# EAGLE design Bertha_v4_4 (EAGLE 6.5.0)
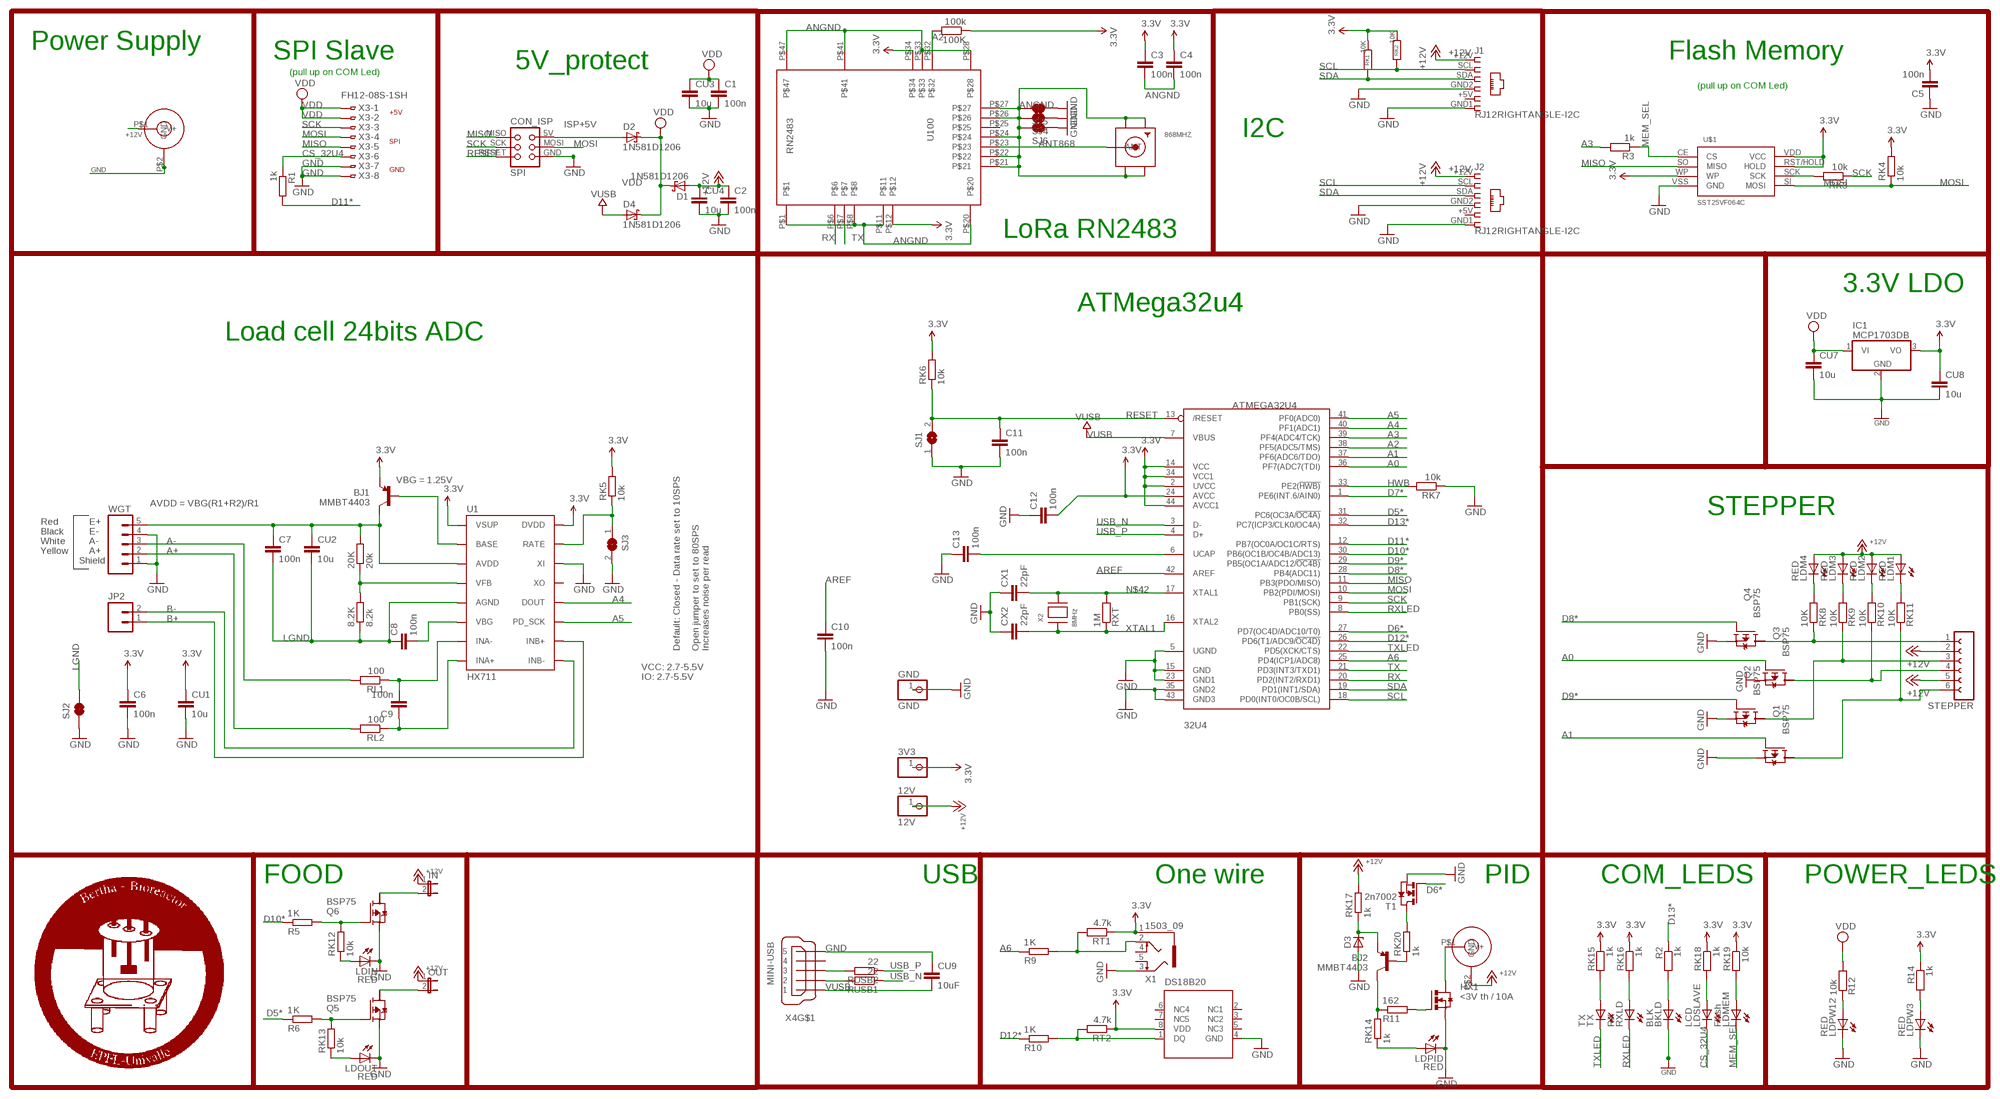
[diagram p0: schematic, sheet 1]

## Parts
3V3  PINHD-1X1  [1X01]
8.2K  8.2k  R-EU_M0805  [M0805]
12V  12V  PINHD-1X1  [1X01]
20K  20k  R-EU_M0805  [M0805]
32U4  ATMEGA32U4  ATMEGA32U4-AU  [TQFP44]
100K  100k  R-EU_R0805  [R0805]
868MHZ  SMACONNECTOR_EDGE  [SMA_EDGELAUNCH]
BJ1  MMBT4403  TRANSISTOR_PNPMMBT4403  [SOT23-3]
BJ2  MMBT4403  TRANSISTOR_PNPMMBT4403  [SOT23-3]
BKLD  BLK  LEDCHIP-LED0805  [CHIP-LED0805]
C1  100n  C-EUC0805  [C0805]
C2  100n  C-EUC0805  [C0805]
C3  100n  C-EUC0805  [C0805]
C4  100n  C-EUC0805  [C0805]
C5  100n  C-EUC0805  [C0805]
C6  100n  C-EUC0805  [C0805]
C7  100n  C-EUC0805  [C0805]
C8  100n  C-EUC0805  [C0805]
C9  100n  C-EUC0805  [C0805]
C10  100n  C-EUC0805  [C0805]
C11  100n  C-EUC0805  [C0805]
C12  100n  C-EUC0805  [C0805]
C13  100n  C-EUC0805  [C0805]
CON1  JACK_DC_BARREL  [DC_BARREL]
CON2  JACK_DC_BARREL  [DC_BARREL]
CON_ISP  SPI  TINYISPT  [TC2030-MCP-NL]
CU1  10u  C-EUC0805  [C0805]
CU2  10u  C-EUC0805  [C0805]
CU3  10u  C-EUC0805  [C0805]
CU4  10u  C-EUC0805  [C0805]
CU7  10u  C-EUC0805  [C0805]
CU8  10u  C-EUC0805  [C0805]
CU9  10uF  C-EUC0805  [C0805]
CX1  22pF  C-EUC0805  [C0805]
CX2  22pF  C-EUC0805  [C0805]
D1  1N581D1206  [LED-1206]
D2  1N581D1206  [LED-1206]
D3  ZENER-DIODEF126-10  [F126Z10]
D4  1N581D1206  [LED-1206]
GND  GND  PINHD-1X1  [1X01]
HX1  <3V th / 10A  IRF3704S  [D2PACK]
IC1  MCP1703DB  [SOT223]
IN  JP1E  [JP1]
J1  RJ12RIGHTANGLE-I2C  [RJ12-RIGHTANGLE-I2C]
J2  RJ12RIGHTANGLE-I2C  [RJ12-RIGHTANGLE-I2C]
JP2  M02PTH  [1X02]
LDIN  RED  LEDCHIP-LED0805  [CHIP-LED0805]
LDM1  RED  LEDCHIP-LED0805  [CHIP-LED0805]
LDM2  RED  LEDCHIP-LED0805  [CHIP-LED0805]
LDM3  RED  LEDCHIP-LED0805  [CHIP-LED0805]
LDM4  RED  LEDCHIP-LED0805  [CHIP-LED0805]
LDMEM  Flash  LEDCHIP-LED0805  [CHIP-LED0805]
LDOUT  RED  LEDCHIP-LED0805  [CHIP-LED0805]
LDPID  RED  LEDCHIP-LED0805  [CHIP-LED0805]
LDPW3  RED  LEDCHIP-LED0805  [CHIP-LED0805]
LDPW12  RED  LEDCHIP-LED0805  [CHIP-LED0805]
LDSLAVE  LCD  LEDCHIP-LED0805  [CHIP-LED0805]
OUT  JP1E  [JP1]
Q1  BSP75  BSP613P  [PG-SOT-223]
Q2  BSP75  BSP613P  [PG-SOT-223]
Q3  BSP75  BSP613P  [PG-SOT-223]
Q4  BSP75  BSP613P  [PG-SOT-223]
Q5  BSP75  BSP613P  [PG-SOT-223]
Q6  BSP75  BSP613P  [PG-SOT-223]
R1  1k  R-EU_R0805  [R0805]
R2  1k  R-EU_R0805  [R0805]
R3  1k  R-EU_R0805  [R0805]
R5  1K  R-EU_R0805  [R0805]
R6  1K  R-EU_R0805  [R0805]
R9  1K  R-EU_R0805  [R0805]
R10  1K  R-EU_R0805  [R0805]
R11  162  R-EU_R0805  [R0805]
R12  10k  R-EU_R0805  [R0805]
R14  1k  R-EU_R0805  [R0805]
RK1  10K  R-EU_M0805  [M0805]
RK2  10K  R-EU_M0805  [M0805]
RK3  10k  R-EU_R0805  [R0805]
RK4  10k  R-EU_R0805  [R0805]
RK5  10k  R-EU_M0805  [M0805]
RK6  10k  R-EU_M0805  [M0805]
RK7  10k  R-EU_M0805  [M0805]
RK8  10K  R-EU_R0805  [R0805]
RK9  10K  R-EU_R0805  [R0805]
RK10  10K  R-EU_R0805  [R0805]
RK11  10K  R-EU_R0805  [R0805]
RK12  10k  R-EU_R0805  [R0805]
RK13  10k  R-EU_R0805  [R0805]
RK14  1k  R-EU_R0805  [R0805]
RK15  1k  R-EU_R0805  [R0805]
RK16  1k  R-EU_R0805  [R0805]
RK17  1k  R-EU_R0805  [R0805]
RK18  1k  R-EU_R0805  [R0805]
RK19  10k  R-EU_R0805  [R0805]
RK20  1k  R-EU_R0805  [R0805]
RL1  100  R-EU_M0805  [M0805]
RL2  100  R-EU_M0805  [M0805]
RT1  4.7k  R-EU_R0805  [R0805]
RT2  4.7k  R-EU_R0805  [R0805]
RUSB1  22  R-EU_M0805  [M0805]
RUSB2  22  R-EU_M0805  [M0805]
RXLD  RX  LEDCHIP-LED0805  [CHIP-LED0805]
RXT  1M  R-EU_R0805  [R0805]
SJ1  SJ  [SJ]
SJ2  JUMPER-PAD-2-NC_BY_TRACE  [PAD-JUMPER-2-NC_BY_TRACE_YES_SILK]
SJ3  SJ  [SJ]
SJ4  JUMPER-PAD-2-NC_BY_TRACE  [PAD-JUMPER-2-NC_BY_TRACE_YES_SILK]
SJ5  JUMPER-PAD-2-NC_BY_TRACE  [PAD-JUMPER-2-NC_BY_TRACE_YES_SILK]
SJ6  JUMPER-PAD-2-NC_BY_TRACE  [PAD-JUMPER-2-NC_BY_TRACE_YES_SILK]
STEPPER  FE06-1  [FE06]
T1  2n7002  NMOSSOT23  [SOT-23]
TX  TX  LEDCHIP-LED0805  [CHIP-LED0805]
U1  HX711  HX711HX711  [SO16]
U100  RN2483  [RN2483]
U$1  SST25VF064C  [SOIC_8-LEAD]
U$2  DS18B20  DS18B20SMALL  [MSOP8]
WGT  M05PTH  [1X05]
X1  1503_09  [1503_09]
X2  8MHz  XTALNX6035  [NX6035]
X3  FH12-08S-1SH  [FH12-08S-1SH]
X4  MINI-USB  MINI-USB-SCHIELD-32005-201  [32005-201]

## Nets
3.3V [power]: 3V3.1 32U4.2(UVCC) 32U4.14(VCC) 32U4.24(AVCC) 32U4.34(VCC1) 32U4.44(AVCC1) 100K.1 BJ1.2(E) C3.1 C4.1 C5.2 C6.1 C12.2 CU1.1 CU8.1 IC1.3(VO) R14.1 RK1.1 RK2.1 RK4.2 RK5.2 RK6.2 RK15.1 RK16.1 RK18.1 RK19.1 RT1.1 RT2.1 U1.1(VSUP) U1.16(DVDD) U100.P$12 U100.P$34 U$1.RST/HOLD(HOLD) U$1.VDD(VCC) U$1.WP U$2.8(VDD) X1.1
+12V [power]: 12V.1 C2.1 CON1.P$1(V+) CON2.P$2(GND) CU4.1 D1.A IN.1 J1.+12V J2.+12V LDM1.A LDM2.A LDM3.A LDM4.A OUT.1 RK17.2 STEPPER.2 STEPPER.5
A0: 32U4.36(PF7(ADC7(TDI)) Q3.1(G)
A1: 32U4.37(PF6(ADC6/TDO)) Q1.1(G)
A2: 32U4.38(PF5(ADC5/TMS)) 100K.2 U100.P$32
A3: 32U4.39(PF4(ADC4/TCK)) R3.2
A4: 32U4.40(PF1(ADC1)) U1.12(DOUT)
A5: 32U4.41(PF0(ADC0)) U1.11(PD_SCK)
A6: 32U4.25(PD4(ICP1/ADC8)) R9.1
A+: RL2.2 WGT.2
A-: RL1.2 WGT.3
ANGND: 868MHZ.GND@1(GND4) 868MHZ.GND@2(GND3) 868MHZ.GND@3(GND2) 868MHZ.GND@4(GND1) C3.2 C4.2 SJ4.2 SJ5.2 SJ6.2 U100.P$1 U100.P$8 U100.P$11 U100.P$20 U100.P$21 U100.P$22 U100.P$24 U100.P$26 U100.P$27 U100.P$28 U100.P$33 U100.P$41 U100.P$47
ANT868: 868MHZ.P(ANT) U100.P$23
AREF: 32U4.42(AREF) C10.1
B+: JP2.1 U1.10(INB+)
B-: JP2.2 U1.9(INB-)
CN3: C8.2 U1.6(VBG)
CS_32U4: LDSLAVE.C R1.1 X3.6
D5*: 32U4.31(PC6(OC3A/!OC4A)) R6.1
D6*: 32U4.27(PD7(OC4D/ADC10/T0)) T1.3(G)
D7*: 32U4.1(PE6(INT.6/AIN0))
D8*: 32U4.28(PB4(ADC11)) Q4.1(G)
D9*: 32U4.29(PB5(OC1A/ADC12/!OC4B)) Q2.1(G)
D10*: 32U4.30(PB6(OC1B/OC4B/ADC13)) R5.1
D11*: 32U4.12(PB7(OC0A/OC1C/RTS)) R1.2
D12*: 32U4.26(PD6(T1/ADC9/!OC4D)) R10.1
D13*: 32U4.32(PC7(ICP3/CLK0/OC4A)) R2.1
GND [power]: 32U4.5(UGND) 32U4.15(GND) 32U4.23(GND1) 32U4.35(GND2) 32U4.43(GND3) BKLD.C C1.2 C2.2 C5.1 C6.2 C10.2 C11.2 C12.1 C13.1 CON1.P$2(GND) CON_ISP.GND CU1.2 CU3.2 CU4.2 CU7.2 CU8.2 CU9.1 CX1.1 CX2.1 D3.A GND.1 HX1.3(S) IC1.2(GND) J1.GND1 J1.GND2 J2.GND1 J2.GND2 LDIN.C LDOUT.C LDPID.C LDPW3.C LDPW12.C Q1.3(S) Q2.3(S) Q3.3(S) Q4.3(S) Q5.3(S) Q6.3(S) RK7.1 SJ1.1 SJ2.1 SJ3.2 SJ4.1 SJ5.1 SJ6.1 T1.2(S) U1.14(XI) U$1.VSS(GND) U$2.4(GND) WGT.1 WGT.4 X1.3 X3.7 X3.8 X4.5
HWB: 32U4.33(PE2(!HWB)) RK7.2
ISP+5V: CON_ISP.5V(VCC) D2.A
LGND: 8.2K.1 C7.2 C8.1 CU2.2 SJ2.2 U1.5(AGND)
MEM_SEL: LDMEM.C R3.1 U$1.CE(CS)
MISO: 32U4.11(PB3(PDO/MISO)) CON_ISP.MISO U$1.SO(MISO) X3.5
MOSI: 32U4.10(PB2(PDI/MOSI)) CON_ISP.MOSI RK4.1 U$1.SI(MOSI) X3.4
N$1: 32U4.6(UCAP) C13.2
N$2: CON2.P$1(V+) HX1.2(D)
N$3: BKLD.A R2.2
N$4: HX1.1(G) R11.2
N$5: 20K.2 BJ1.3(C) C7.1 CU2.1 U1.3(AVDD) WGT.5
N$6: BJ2.3(C) R11.1 RK14.2
N$7: LDPW12.A R12.1
N$8: Q6.1(G) R5.2 RK12.2
N$9 [power]: R10.2 RT2.2 U$2.1(DQ)
N$10: BJ2.2(E) D3.C RK17.1
N$11: Q5.1(G) R6.2 RK13.2
N$12: BJ2.1(B) RK20.1
N$13: OUT.2 Q5.2(D)
N$14 [power]: Q4.2(D) RK8.1 STEPPER.1
N$15 [power]: Q2.2(D) RK9.1 STEPPER.3
N$16 [power]: Q3.2(D) RK10.1 STEPPER.4
N$17: IN.2 Q6.2(D)
N$18: RK15.2 TX.A
N$19 [power]: Q1.2(D) RK11.1 STEPPER.6
N$20: C9.2 RL1.1 U1.7(INA-)
N$21 [power]: R9.2 RT1.2 X1.2
N$22: LDSLAVE.A RK18.2
N$23: RK3.2 U$1.SCK
N$24: RK16.2 RXLD.A
N$25: LDMEM.A RK19.2
N$26 [power]: LDPID.A RK14.1
N$27: LDIN.A RK12.1
N$28: LDOUT.A RK13.1
N$29: RK20.2 T1.1(D)
N$31: LDM4.C RK8.2
N$32: LDM3.C RK9.2
N$33: LDM2.C RK10.2
N$34: LDPW3.A R14.2
N$37: LDM1.C RK11.2
N$38: BJ1.1(B) U1.2(BASE)
N$39: 8.2K.2 20K.1 U1.4(VFB)
N$41: RK5.1 SJ3.1 U1.15(RATE)
N$42: 32U4.17(XTAL1) CX1.2 RXT.2 X2.P$2
N$43: C9.1 RL2.1 U1.8(INA+)
RESET: 32U4.13(/RESET) C11.1 CON_ISP.RESET RK6.1 SJ1.2
RX: 32U4.20(PD2(INT2/RXD1)) U100.P$6
RXLED: 32U4.8(PB0(SS)) RXLD.C
SCK: 32U4.9(PB1(SCK)) CON_ISP.SCK RK3.1 X3.3
SCL: 32U4.18(PD0(INT0/OC0B/SCL)) J1.SCL J2.SCL RK2.2
SDA: 32U4.19(PD1(INT1/SDA)) J1.SDA J2.SDA RK1.2
TX: 32U4.21(PD3(INT3/TXD1)) U100.P$7
TXLED: 32U4.22(PD5(XCK/CTS)) TX.C
USB_N: 32U4.3(D-) RUSB1.1
USB_P: 32U4.4(D+) RUSB2.1
USBC_N: RUSB1.2 X4.2
USBC_P: RUSB2.2 X4.3
VDD [power]: C1.1 CU3.1 CU7.1 D1.C D2.C D4.C IC1.1(VI) R12.2 X3.1 X3.2
VUSB: 32U4.7(VBUS) CU9.2 D4.A X4.1
XTAL1: 32U4.16(XTAL2) CX2.2 RXT.1 X2.P$1
Unconnected: Q1.4(D) Q2.4(D) Q3.4(D) Q4.4(D) Q5.4(D) Q6.4(D) U1.13(XO) U100.P$25 U$2.2(NC1) U$2.3(NC2) U$2.5(NC3) U$2.6(NC4) U$2.7(NC5) X1.4 X1.5 X4.4 X4.M1(S:S1) X4.M2(S:S2) X4.M3(S:S3) X4.M4(S:S4)

## Notes on the sheet
- Power Supply
- SPI Slave | Flash Memory
- 5V_protect
- (pull up on COM Led)
- (pull up on COM Led)
- +5V
- I2C
- SPI
- GND
- LoRa RN2483
- 3.3V LDO
- ATMega32u4
- Load cell 24bits ADC
- VBG = 1.25V
- AVDD = VBG(R1+R2)/R1
- STEPPER
- Red | E+
- Black | E-
- White | A-
- Yellow | A+
- Shield
- Default: Closed - Data rate set to 10SPS
- Open jumper to set to 80SPS
  Increases noise per read
- VCC: 2.7-5.5V
- IO: 2.7-5.5V
- FOOD | USB | One wire | PID | COM_LEDS | POWER_LEDS

## Power pins joined to a net without a drawn wire
5: J1.+5V J2.+5V

## Library data of the parts
3V3 12V GND = Headerlibrary:PINHD-1X1: PIN HEADER
8.2K 20K R14 RK1 RK2 RK5-RK7 RL1 RL2 RT1 RT2 RUSB1 RUSB2 = resistor:R-EU_: RESISTOR, European symbol
32U4 = adafruit:ATMEGA32U4: http://www.ladyada.net/library/eagle
100K R1-R3 R5 R6 R9-R12 RK3 RK4 RK8-RK20 RXT = rcl:R-EU_: RESISTOR, European symbol
868MHZ = sma_end_launch:SMACONNECTOR: SMA Connector 90° DIP SMA Connector, 50 Ohm (4UConnector: 07259)
BJ1 BJ2 = SparkFun-DiscreteSemi:TRANSISTOR_PNP: Generic PNP BJT Double check pinouts against datasheets- not all devices are the same! MMBT3906 - 40V 200mA SOT-23 (TRANS-08052) MMBT4403 - 40V 600mA SOT-23 (TRANS-09245); PROD_ID: TRANS-09245
BKLD LDIN LDM1-LDM4 LDMEM LDOUT LDPID LDPW3 LDPW12 LDSLAVE RXLD TX = adafruit:LED: LED OSRAM: - CHIPLED LG R971, LG N971, LY N971, LG Q971, LY Q971, LO R971, LY R971 LH N974, LH R974 LS Q976, LO Q976, LY Q976 LO Q996 - Hyper CHIPLED LW Q18S LB Q993, LB Q99A, LB R99A - SideLED LS A670, LO A670, LY A670, LG A670, LP A670 LB A673, LV A673, LT A673, LW A673 LH A674 LY A675 LS A676, LA A676, LO A676, LY A676, LW A676 LS A679, LY A679, LG A679 - Hyper Micro SIDELED® LS Y876, LA Y876, LO Y876, LY Y876 LT Y87S - SmartLED LW L88C, LW L88S LB L89C, LB L89S, LG L890 LS L89K, LO L89K, LY L89K LS L896, LA L896, LO L896, LY L896 - TOPLED LS T670, LO T670, LY T670, LG T670, LP T670 LSG T670, LSP T670, LSY T670, LOP T670, LYG T670 LG T671, LOG T671, LSG T671 LB T673, LV T673, LT T673, LW T673 LH T674 LS T676, LA T676, LO T676, LY T676, LB T676, LH T676, LSB T676, LW T676 LB T67C, LV T67C, LT T67C, LS T67K, LO T67K, LY T67K, LW E67C LS E67B, LA E67B, LO E67B, LY E67B, LB E67C, LV E67C, LT E67C LW T67C LS T679, LY T679, LG T679 LS T770, LO T770, LY T770, LG T770, LP T770 LB T773, LV T773, LT T773, LW T773 LH T774 LS E675, LA E675, LY E675, LS T675 LS T776, LA T776, LO T776, LY T776, LB T776 LHGB T686 LT T68C, LB T68C - Hyper Mini TOPLED® LB M676 - Mini TOPLED Santana® LG M470 LS M47K, LO M47K, LY M47K Source: http://www.osram.convergy.de/
C1-C13 CU1-CU4 CU7-CU9 CX1 CX2 = rcl:C-EU: CAPACITOR, European symbol
CON1 CON2 = lpatiny:JACK_DC_BARREL
CON_ISP = lpatiny:TINYISP: CONNECTOR
D1 D2 D4 = lpatiny:1N581*: 1.0A SCHOTTKY BARRIER RECTIFIER Source: http://www.diodes.com/datasheets/ds23001.pdf
D3 = diode:ZENER-DIODE: Z-Diode
HX1 = transistor-power:IRF3704: SMPS MOSFET HEXFET® Power MOSFET Source: http://www.irf.com/product-info/datasheets/data/irf3704.pdf
IC1 = linear:MCP1703: 250 mA, 16V, Low Quiescent Current LDO Regulator Source: http://ww1.microchip.com/downloads/en/DeviceDoc/22049b.pdf
IN OUT = jumper:JP1E: JUMPER
J1 J2 = lpatiny:RJ12: CORCOM Modular RJ Jacks No Shield Source: www.tycoelectronics.com .. ENG_DS_1654001_1099_RJ_L_0507.pdf
JP2 = SparkFun-Connectors:M02: Standard 2-pin 0.1" header. Use with - straight break away headers ( PRT-00116) - right angle break away headers (PRT-00553) - swiss pins (PRT-00743) - machine pins (PRT-00117) - female headers (PRT-00115) Molex polarized connector foot print use with: PRT-08233 with associated crimp pins and housings. 2.54_SCREWTERM for use with PRT-10571. 3.5mm Screw Terminal footprints for PRT-08084 5mm Screw Terminal footprints for use with PRT-08432
Q1-Q6 = infineon:BSP613P: SIPMOS (R) Small-Signal-Transistor P-Channel (2 Drain) Source: http://www.infineon.com/dgdl/BSP613P_Rev2.4.pdf; OC_FARNELL: unknown; OC_NEWARK: unknown
SJ1 SJ3 = jumper:SJ: SMD solder JUMPER
SJ2 SJ4-SJ6 = SparkFun-Passives:JUMPER-PAD-2-NC_BY_TRACE
STEPPER = con-lsta:FE06-1: FEMALE HEADER; OC_FARNELL: unknown; OC_NEWARK: unknown
T1 = zetex:NMOSSOT23: MOS FET; OC_FARNELL: unknown; OC_NEWARK: unknown
U1 = Testing:HX711; PROD_ID: IC-12445
U100 = Octanis1:RN2483: Microchip Low-Power Long Range LoRaTM Technology Transceiver Module
U$1 = BertaLib:SST25VF064C
U$2 = lpatiny:DS18B20
WGT = SparkFun-Connectors:M05: Header 5 Standard 5-pin 0.1" header. Use with straight break away headers (SKU : PRT-00116), right angle break away headers (PRT-00553), swiss pins (PRT-00743), machine pins (PRT-00117), and female headers (PRT-00115). Molex polarized connector foot print use with SKU : PRT-08230 with associated crimp pins and housings.
X1 = con-lumberg:1503_09: Jack connectors according to JISC 6560, 3.5 mm Klinkeneinbaukupplung nach JISC 6560, 3,5 mm, 3-polig/ stereo, abgewinkelte Ausführung, mit 2 Öffnern und Lötaugen, für Leiterplatten Rückseitenmontage Source: http://www.lumberg.com/Produkte/PDFs/1503_09.pdf; OC_FARNELL: 1243244; OC_NEWARK: unknown
X2 = lpatiny:XTAL: Low cost SMT crystals, no capacitors included http://www.ladyada.net/library/eagle
X3 = con-hirose:FH12-08S-1S: 1mm Pitch Connectors For FPC/FFC Source: Data sheet <http://www.hirose.co.jp/cataloge_hp/e58605370.pdf>; OC_FARNELL: unknown; OC_NEWARK: unknown
X4 = con-cypressindustries:MINI-USB-SCHIELD-: MINI USB-B Conector Source: www.cypressindustries.com; OC_FARNELL: unknown; OC_NEWARK: unknown

## Net classes
0 default: width 0.203 mm, clearance 0.25 mm
1 power: width 0.203 mm, drill 0.305 mm, clearance 0.25 mm
2 VIN: width 0.457 mm, clearance 0.25 mm
3 fine: width 0.254 mm, clearance 0.25 mm
4 aref: width 0.356 mm, clearance 0.25 mm

## Board
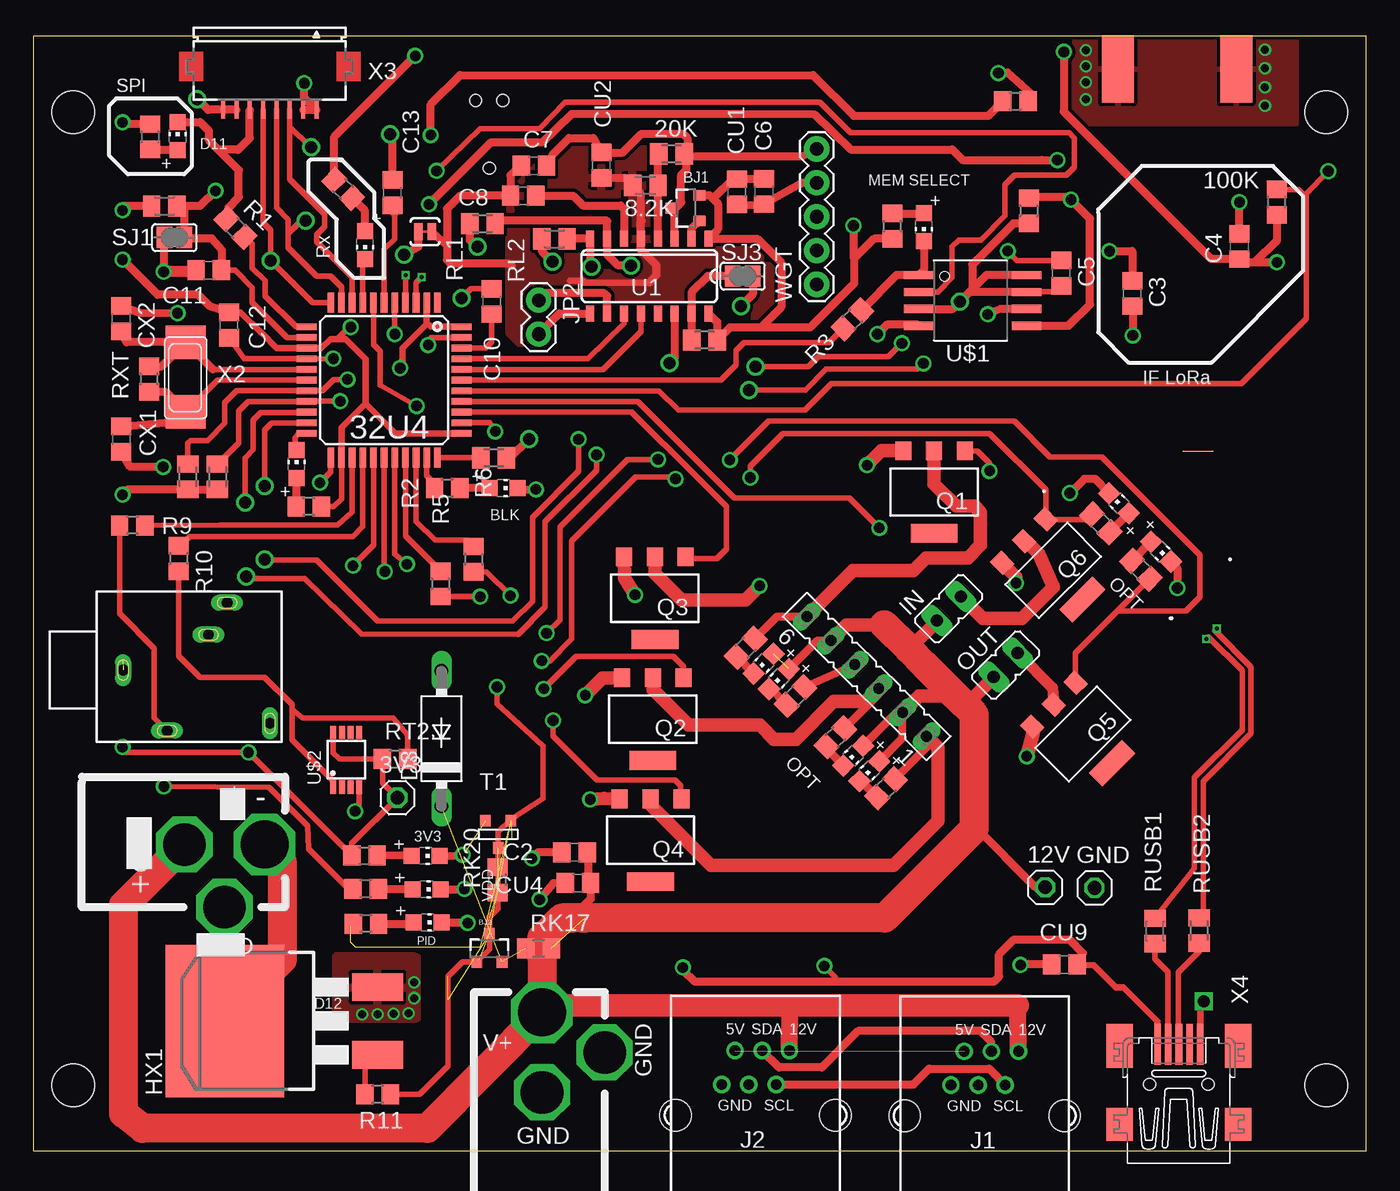
[diagram p1: board, top side]
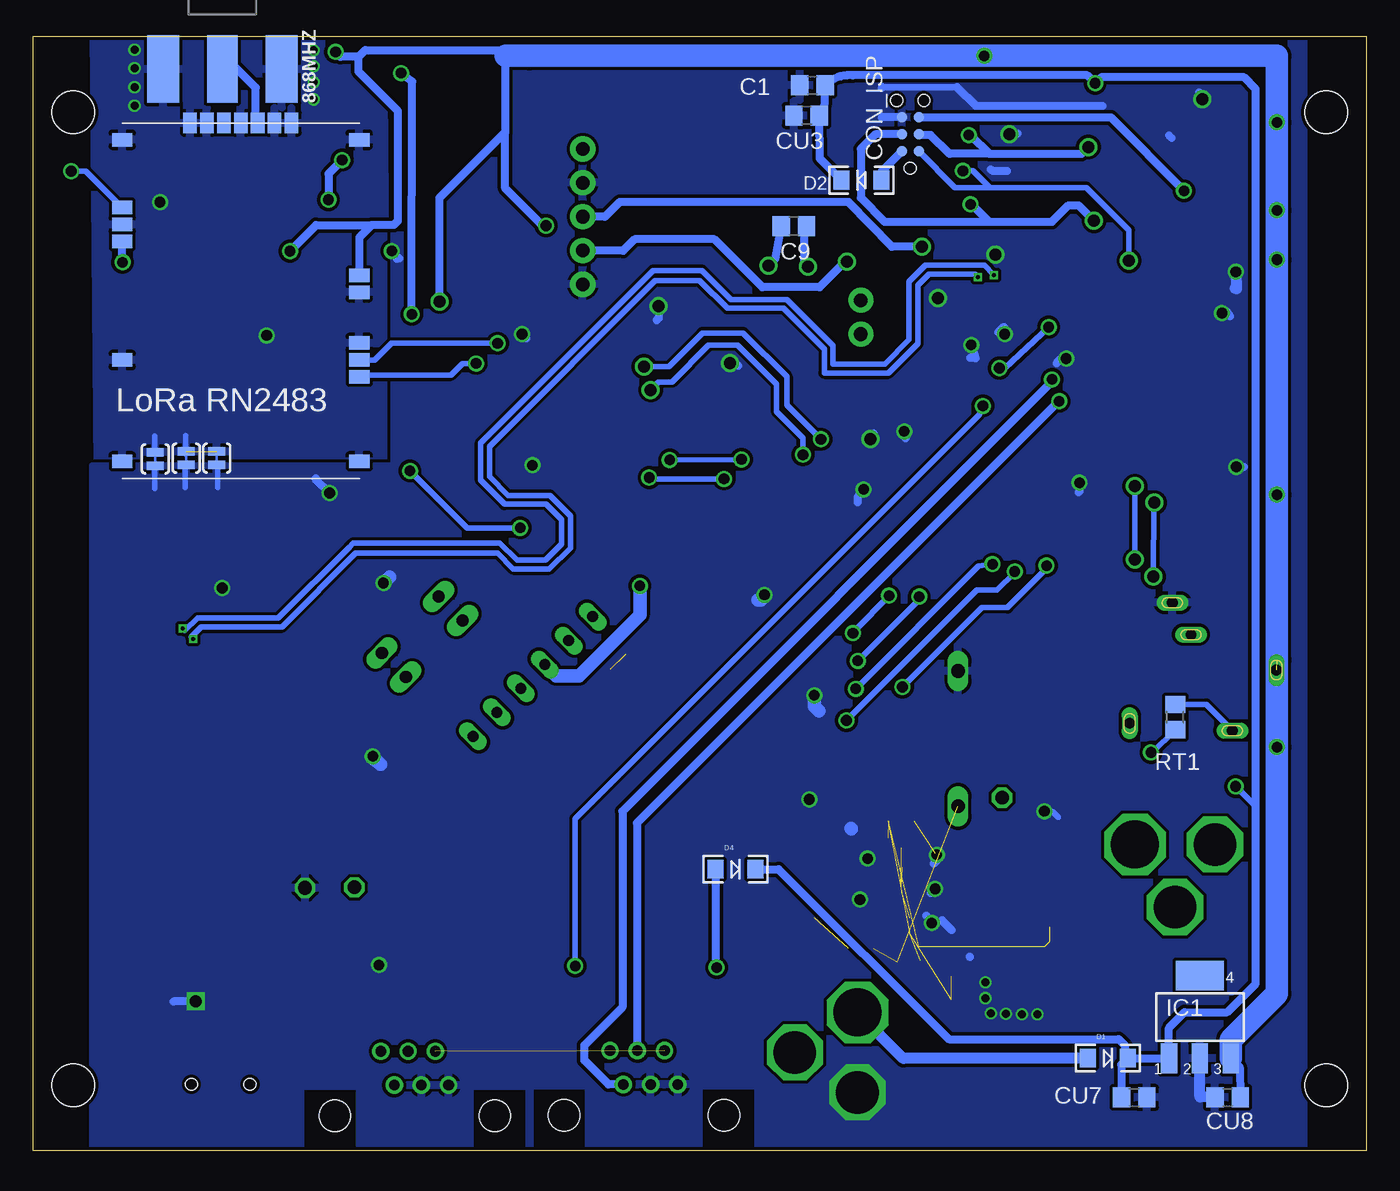
[diagram p2: board, bottom side, seen from below]

Size 100 x 83.6 mm. Coordinates in mm from the lower left corner, seen from the top.
Outline: 0,0 100,0 100,83.6 0,83.6 0,0
Copper layers (1*2*15*16): Top 0.035mm / dielectric 0.2mm / layer 2 0.0175mm / dielectric 1.1mm / layer 15 0.0175mm / dielectric 0.2mm / Bottom 0.035mm
Design rules "SeeedStudio_DRU_no_angle_20130527": minimum track width 6mil, minimum drill 12mil, track to track 6mil, track to pad 6mil, pad to pad 6mil, via to via 6mil, smd to smd 0mil, copper to edge 10mil, drill to drill 10mil, minimum pad ring 6mil, minimum via ring 6mil, stop-mask expansion 2mil, vias tented up to drill 25mil, thermal gap 10mil
Holes 3.2 mm at 3,77.9 97,77.9 3,4.9 97,4.9
vRestrict: area 13.7,77 to 21.9,80.8

### Footprints (pad centres in the part's own frame; a part is rotated, then mirrored left to right if it is on the bottom)
1X01 = drill 1.016 octagon: 1 0,0
M0805 = smd 1.3 x 1.6: 1 -0.95,0; 2 0.95,0
TQFP44 = smd 1.5 x 0.5: 1 -5.8,4; 2 -5.8,3.2; 3 -5.8,2.4; 4 -5.8,1.6; 5 -5.8,0.8; 6 -5.8,0; 7 -5.8,-0.8; 8 -5.8,-1.6; 9 -5.8,-2.4; 10 -5.8,-3.2; 11 -5.8,-4; 23 5.8,-4; 24 5.8,-3.2; 25 5.8,-2.4; 26 5.8,-1.6; 27 5.8,-0.8; 28 5.8,0; 29 5.8,0.8; 30 5.8,1.6; 31 5.8,2.4; 32 5.8,3.2; 33 5.8,4 | smd 0.5 x 1.5: 12 -4,-5.8; 13 -3.2,-5.8; 14 -2.4,-5.8; 15 -1.6,-5.8; 16 -0.8,-5.8; 17 0,-5.8; 18 0.8,-5.8; 19 1.6,-5.8; 20 2.4,-5.8; 21 3.2,-5.8; 22 4,-5.8; 34 4,5.8; 35 3.2,5.8; 36 2.4,5.8; 37 1.6,5.8; 38 0.8,5.8; 39 0,5.8; 40 -0.8,5.8; 41 -1.6,5.8; 42 -2.4,5.8; 43 -3.2,5.8; 44 -4,5.8
R0805 = smd 1.3 x 1.5: 1 -0.95,0; 2 0.95,0
SMA_EDGELAUNCH = smd 5.08 x 2.413: GND@1 2.54,-4.445; GND@2 2.54,4.445 | smd 5.08 x 2.413 bottom: GND@3 2.54,4.445; GND@4 2.54,-4.445 | smd 5.08 x 2.286: P 2.54,0
SOT23-3 = smd 0.8 x 0.9: 1 -0.95,-1; 2 0.95,-1; 3 0,1.1
CHIP-LED0805 = smd 1.2 x 1.2: A 0,-1.05; C 0,1.05
C0805 = smd 1.3 x 1.5: 1 -0.95,0; 2 0.95,0
DC_BARREL = drill 3.6 pad 4.5 octagon: P$1 0,13.7 | drill 3.2 pad 4.064 octagon: P$2 0,7.7; P$3 4.7,10.7
TC2030-MCP-NL = smd 0.787 x 0.787: 5V 1.27,0.635; GND 3.81,0.635; MISO 1.27,-0.635; MOSI 2.54,0.635; RESET 3.81,-0.635; SCK 2.54,-0.635 | hole 0.889: 0,0; 5.08,-1.016; 5.08,1.016
LED-1206 = smd 1.2 x 1.4: A -1.5,0; C 1.5,0
F126Z10 = drill 1.016 long: A 5.08,0; C -5.08,0
D2PACK = smd 2.083 x 3.81: 1 -2.54,-8.89; 3 2.54,-8.89 | smd 11.43 x 8.89: 2 0,2.54
SOT223 = smd 1.219 x 2.235: 1 -2.311,-3.099; 2 0,-3.099; 3 2.311,-3.099 | smd 3.6 x 2.2: 4 0,3.099
JP1 = drill 0.914 long: 1 0,-1.27; 2 0,1.27
RJ12-RIGHTANGLE-I2C = drill 0.8 pad 1.3: +5V -1.54,4.84; +12V 2.54,4.84; GND1 -2.54,2.3; GND2 -0.5,2.3; SCL 1.54,2.3; SDA 0.5,4.84 | hole 2.36: -6,0; 6,0
1X02 = drill 1.016 pad 1.88: 1 0,0; 2 2.54,0
PG-SOT-223 = smd 1.2 x 1.4: 1 -2.311,-3.099; 2 0,-3.099; 3 2.311,-3.099 | smd 3.5 x 1.4: 4 0,3.099
SJ = smd 1.168 x 1.6: 1 -0.762,0; 2 0.762,0
PAD-JUMPER-2-NC_BY_TRACE_YES_SILK = smd 0.635 x 1.27: 1 -0.508,0; 2 0.508,0
FE06 = drill 0.813 long: 1 -6.35,0; 2 -3.81,0; 3 -1.27,0; 4 1.27,0; 5 3.81,0; 6 6.35,0
SOT-23 = smd 0.787 x 0.889: 1 0.025,-1.016; 2 -0.94,1.016; 3 0.991,1.016
SO16 = smd 0.6 x 1.2: 1 -4.445,-2.8; 2 -3.175,-2.8; 3 -1.905,-2.8; 4 -0.635,-2.8; 5 0.635,-2.8; 6 1.905,-2.8; 7 3.175,-2.8; 8 4.445,-2.8; 9 4.445,2.8; 10 3.175,2.8; 11 1.905,2.8; 12 0.635,2.8; 13 -0.635,2.8; 14 -1.905,2.8; 15 -3.175,2.8; 16 -4.445,2.8
RN2483 = smd 1.524 x 1.016: P$1 17.78,1.27; P$6 17.78,7.62; P$7 17.78,8.89; P$8 17.78,10.16; P$11 17.78,13.97; P$12 17.78,15.24; P$20 17.78,25.4; P$28 0,25.4; P$32 0,20.32; P$33 0,19.05; P$34 0,17.78; P$41 0,8.89; P$47 0,1.27 | smd 1.016 x 1.524: P$21 12.7,26.67; P$22 11.43,26.67; P$23 10.16,26.67; P$24 8.89,26.67; P$25 7.62,26.67; P$26 6.35,26.67; P$27 5.08,26.67
SOIC_8-LEAD = smd 0.61 x 2.21: CE -1.905,-2.934; RST/HOLD -0.635,5.156; SCK 0.635,5.156; SI 1.905,5.156; SO -0.635,-2.934; VDD -1.905,5.156; VSS 1.905,-2.934; WP 0.635,-2.934
MSOP8 = smd 0.45 x 1: 1 -0.975,-2.05; 2 -0.325,-2.05; 3 0.325,-2.05; 4 0.975,-2.05; 5 0.975,2.05; 6 0.325,2.05; 7 -0.325,2.05; 8 -0.975,2.05
1X05 = drill 1.016 pad 1.88: 1 0,0; 2 2.54,0; 3 5.08,0; 4 7.62,0; 5 10.16,0
1503_09 = drill 0.8 pad 1.2 long: 1 0,-2.1; 2 -4.55,-5.4; 3 5.05,-9.9; 4 -4,-13.1; 5 2.65,-8.5
NX6035 = smd 2.5 x 3: P$1 2.665,0; P$2 -2.565,0
FH12-08S-1SH = smd 0.3 x 1.3: 1 -3.5,3.25; 2 -2.5,3.25; 3 -1.5,3.25; 4 -0.5,3.25; 5 0.5,3.25; 6 1.5,3.25; 7 2.5,3.25; 8 3.5,3.25
32005-201 = smd 3.1 x 0.5: 1 3,1.6; 2 3,0.8; 3 3,0; 4 3,-0.8; 5 3,-1.6 | smd 2.5 x 2: M1 -3,-4.45; M2 -3,4.45 | smd 3.3 x 2: M3 2.9,4.45; M4 2.9,-4.45 | hole 0.9: 0,2.2; 0,-2.2

### Placement (x,y rotation side)
3V3  27.31,26.48 0 top
8.2K  45.92,72.41 0 top
12V  75.9,19.75 0 top
20K  47.88,74.77 0 top
32U4  26.31,57.81 270 top
100K  93.29,71.16 90 top
868MHZ  85.8,83.68 270 bottom
BJ1  48.97,70.71 90 top
BJ2  34.21,15.14 0 top
BKLD  35.29,49.7 270 top
C1  41.55,79.92 180 bottom
C2  40.6,22.38 180 top
C3  82.44,64.31 270 top
C4  90.48,67.84 90 top
C5  77.11,65.84 270 top
C6  54.82,71.96 270 top
C7  37.55,73.88 180 top
C8  36.76,71.63 0 top
C9  42.94,69.36 180 bottom
C10  34.4,63.71 90 top
C11  13.17,66.04 180 top
C12  14.68,61.93 90 top
C13  26.94,71.87 270 top
CON1  38.16,-3.34 0 top
CON2  3.64,22.96 270 top
CON_ISP  34.21,73.71 90 bottom
CU1  52.78,71.94 270 top
CU2  42.62,73.94 270 top
CU3  41.98,77.66 180 bottom
CU4  40.86,20.08 180 top
CU7  17.41,3.98 0 bottom
CU8  10.39,3.99 180 bottom
CU9  77.35,13.95 0 top
CX1  6.6,53.38 90 top
CX2  6.6,62.42 270 top
D1  19.37,6.94 0 bottom
D2  37.87,72.81 180 bottom
D3  30.62,30.9 90 top
D4  47.3,21.11 0 bottom
GND  79.61,19.71 0 top
HX1  16.93,9.72 90 top
IC1  12.47,10.02 0 bottom
IN  68.69,40.67 315 top
J1  71.38,2.61 0 top
J2  54.19,2.66 0 top
JP2  37.91,63.8 270 top
LDIN  81.44,48.57 45 top
LDM1  54.79,36.53 135 top
LDM2  55.93,35.38 135 top
LDM3  61.52,29.63 135 top
LDM4  62.72,28.46 135 top
LDMEM  66.8,69.28 180 top
LDOUT  84.6,44.94 225 top
LDPID  29.57,17.13 270 top
LDPW3  29.44,22.12 270 top
LDPW12  29.49,19.6 270 top
LDSLAVE  10.83,76.12 0 top
OUT  72.95,36.43 315 top
Q1  67.58,49.41 180 top
Q2  46.48,32.37 180 top
Q3  46.64,41.44 180 top
Q4  46.31,23.28 180 top
Q5  78.75,31.26 225 top
Q6  76.51,43.53 225 top
R1  15.17,69.23 315 top
R2  31.05,49.72 0 top
R3  61.45,62.37 225 top
R5  30.55,42.52 270 top
R6  33.05,44.37 270 top
R9  7.43,46.91 180 top
R10  10.92,44.42 270 top
R11  25.83,4.21 180 top
R12  24.93,19.64 180 top
R14  24.84,22.13 0 top
RK1  13.82,50.55 90 top
RK2  11.6,50.56 90 top
RK3  73.68,78.73 0 top
RK4  74.69,70.5 270 top
RK5  50.36,60.81 0 top
RK6  9.84,70.86 180 top
RK7  34.54,51.98 180 top
RK8  63.97,27.19 225 top
RK9  60.18,31.01 225 top
RK10  57.18,34.11 225 top
RK11  53.45,37.73 225 top
RK12  80.09,47.05 135 top
RK13  83.09,43.59 315 top
RK14  24.96,17.03 180 top
RK15  20.67,48.32 180 top
RK16  23.25,72.15 315 top
RK17  37.91,15.17 0 top
RK18  8.76,76.06 270 top
RK19  64.46,69.36 90 top
RK20  34.83,20.31 90 top
RL1  33.7,69.55 180 top
RL2  39.09,68.39 180 top
RT1  14.34,32.52 90 bottom
RT2  27.15,29.38 0 top
RUSB1  84.16,16.47 270 top
RUSB2  87.47,16.5 270 top
RXLD  24.88,67.93 180 top
RXT  8.68,57.89 270 top
SJ1  10.59,68.5 0 top
SJ2  29.39,68.93 0 top
SJ3  53.22,65.61 0 top
SJ4  88.53,51.95 90 bottom
SJ5  86.23,51.95 90 bottom
SJ6  90.85,51.89 90 bottom
STEPPER  62.53,35.57 135 top
T1  34.85,23.73 0 top
TX  19.75,51.51 0 top
U1  46.22,65.61 180 top
U100  93.33,50.43 0 bottom
U$1  69.37,63.79 270 top
U$2  23.48,29.32 0 top
WGT  58.78,64.99 90 top
X1  4.64,36.05 90 top
X2  11.43,57.99 90 top
X3  17.75,81.33 180 top
X4  85.94,4.98 90 top

### Tracks (layer width: path | path; a pad name or v marks a point on that pad's centre or on a via)
3.3V  (via drill 0.8, 0.8 pad 0.81, 0.9 pad 0.61)  (1 unrouted)
  Top 0.406: 20.53,60.21 32U4.14 | RK15.1 22.54,48.32 23.11,48.89 32U4.24 | 74.54,64.44 76.66,64.44 arc90 C5.2 | v6.7,30.27 arc90 7.1,29.87 v16.15,29.87 R14.1 23.89,23.05 3V3.1 26.2,27.59 RT2.1 23,29.38 22.49,29.84 22.49,31.34 U$2.8
  Top 0.5: 24.93,56.06 23.11,54.24 32U4.24 | 24.93,56.06 24.93,59.39 23.44,60.88 22.81,60.88 | 22.81,60.88 22.3,60.88 21.58,60.21 20.53,60.21 | 32U4.34 27.18,53.81 24.93,56.06 | 32U4.44 29.83,61.81 29.52,62.12 | 32U4.2 29.52,62.12 | 29.52,62.12 29.52,62.02 27.7,60.2 27.7,58.89 v27.52,58.71 | 23.81,61.88 22.81,60.88 | 32U4.14 18.27,60.21 17.15,61.33 17.12,61.33 15.57,62.88 C12.2
  Top 0.61: U$1.WP 68.97,63.15 v69.52,63.7 | U$1.VDD 71.51,65.69 70.46,64.64 | 70.46,64.64 v69.52,63.7 | v69.52,63.7 70.24,64.42 U$1.RST/HOLD 74.54,64.44 | RK4.2 73.53,69.55 70.46,66.48 70.46,64.64 | 91.65,66.65 90.69,66.65 arc90 C4.1 88.38,66.89 77.32,77.95 v77.32,82.43 | 91.65,66.65 v93.3,66.65 | 93.32,68.32 93.29,68.29 | 93.29,68.29 91.65,66.65 | 100K.1 93.29,68.29 | v23.81,61.78 23.81,61.88 | 54.59,61.76 58.28,61.76 61.58,65.06 61.58,66.9 | 54.59,61.76 52.26,61.76 RK5.2 51.31,62.16 U1.16 | 54.59,61.76 56.11,63.29 56.11,66.62 54.32,68.41 U1.1 51.36,69.1 51.36,71.05 51,71.42 | 51,71.42 50.75,71.66 BJ1.2 | 51,71.42 52.59,73.01 CU1.1 52.78,72.92 C6.1 | RK6.2 6.7,70.86 v6.7,70.55 | C12.2 13.27,63.33 12.38,64.22 9.32,64.22 v6.7,66.84 | RK18.1 6.7,77.01 v6.7,77.15 | v6.7,49.21 7.11,49.61 RK2.1 13.81,49.61 RK1.1 | RK16.1 22.58,76.06 v28.66,82.14 | v80.74,67.48 82.44,67.48 C3.1 82.34,65.16 | 61.58,66.9 61.58,69.35 v61.53,69.39 | RK19.1 63.08,68.41 61.58,66.9
  Bottom 0.406: v16.15,29.87 16.04,29.87 RT1.1
  Bottom 0.5: v27.52,58.71 27.11,58.71 v23.81,61.78
  Bottom 0.61: v69.52,63.7 69.52,71.48 64.59,76.41 | 75.61,82.06 75.61,80.95 72.65,77.99 72.65,69.76 72.97,69.44 74.62,69.44 | 75.61,82.06 75.1,82.57 63.2,82.57 62.77,82.14 | 64.59,76.41 64.59,81.9 64.36,82.14 | v93.3,66.65 arc90 93.33,66.67 U100.P$34 | 75.61,82.06 76.95,82.06 v77.32,82.43 | 6.7,36.81 6.7,36.84 | 64.59,76.41 64.59,72.19 61.79,69.39 v61.53,69.39 | IC1.3 9.49,6.25 CU8.1 | 74.62,69.44 75.55,68.51 U100.P$12 | 74.62,69.44 78.79,69.44 v80.74,67.48
  Bottom 1.676: IC1.3 10.16,8.31 6.7,11.78 v6.7,30.27 6.7,36.81 | 6.7,36.84 v6.7,49.21 v6.7,66.84 v6.7,70.55 v6.7,77.15 6.7,82.14 v28.66,82.14 62.77,82.14 64.36,82.14 64.55,82.14 64.55,82.15
5  (1 unrouted)
+12V  (2 unrouted)
  Top 0.61: 59.69,38.27 STEPPER.5 58.82,38.27 LDM2.A | LDM4.A 65.22,30.96 STEPPER.2 64.77,32.88 LDM3.A | 12V.1 75.19,19.75 70.59,24.35 | 38.16,14.54 38.16,14.43 | CU4.1 41.81,18.87 40.39,17.45 | 41.66,20.38 41.66,22.21 C2.1
  Top 0.813: 41.66,20.38 CU4.1 | 40.94,16.93 40.97,16.96 40.97,17.03 41.38,17.45 | 40.97,17.63 41.16,17.45
  Top 1.016: STEPPER.2 66.45,34.11 69.2,34.11 | STEPPER.5 61.02,39.45 63.85,39.45 | 70.59,29.43 70.59,28.5 | OUT.1 70.59,34.07 70.59,32.01 | IN.1 67.79,39.71 65.69,37.62
  Top 1.27: J2.+12V 56.78,10.89 | J1.+12V 73.88,10.89
  Top 1.676: 73.88,10.89 56.78,10.89 38.8,10.89 38.8,10.64 38.69,10.64 38.16,10.64 CON1.P$1
  Top 2.184: 38.69,10.64 38.16,11.17 38.16,14.43 38.16,15.97 39.64,17.45 40.39,17.45 41.16,17.45 41.38,17.45 63.88,17.45 70.59,24.16 70.59,24.35 70.59,28.5 70.59,32.01 70.59,32.72 69.2,34.11 66.9,36.4 65.69,37.62 63.85,39.45 | CON1.P$1 29.56,1.65 8.19,1.65 6.78,2.79 6.78,18.4 CON2.P$2
  Bottom 0.813: CON1.P$1 34.7,6.9 34.67,6.94 D1.A
A0
  Top 0.406: 32U4.36 44.93,55.41 44.93,55.38 47.29,53.02 47.33,53.02 52.01,48.34 52.01,45.15 51.3,44.44 49.05,44.44 Q3.1 49.06,44.12
A1  (via drill 0.8)
  Top 0.406: 32U4.37 45.38,56.21 52.62,48.96 61.22,48.96 v63.47,46.72 | v71.75,50.99 71.75,51.58 70.85,52.48 69.92,52.48 Q1.1
  Bottom 0.406: v63.47,46.72 67.47,46.72 v71.75,50.99
A2  (via drill 0.8)
  Top 0.406: 32U4.38 32.12,57 46.96,57 48.4,55.56 57.91,55.56 59.9,57.55 90.63,57.55 95.49,62.41 95.49,71.33 95.49,71.58 | 95.49,71.58 94.95,72.11 100K.2 | v97.16,73.48 95.49,71.81 95.49,71.58
  Bottom 0.406: U100.P$32 96.05,73.48 v97.16,73.48
A3
  Top 0.406: 32U4.39 32.19,57.81 51.59,57.81 52.72,58.94 52.72,60.01 53.32,60.61 59.69,60.61 R3.2
A4
  Top 0.406: 32U4.40 42.76,58.61 45.58,61.43 U1.12
A5
  Top 0.406: U1.11 44.31,62.06 41.62,59.42 41.61,59.41 32U4.41
A6
  Top 0.406: 32U4.25 23.91,47.91 22.84,46.92 14.02,46.92 R9.1
A+  (via drill 0.9 pad 0.81)
  Top 0.61: RL2.2 38.14,67.5 v38.95,66.69
  Bottom 0.61: v38.95,66.69 39.09,66.69 41.01,64.78 45.31,64.78 46.83,66.3 | 46.83,66.3 | 46.83,66.3 48.9,68.37 54.88,68.37 55.74,67.5 WGT.2
A-  (via drill 0.9 pad 0.81)
  Top 0.61: RL1.2 32.75,68.3 v33.32,67.81
  Bottom 0.61: v33.32,67.81 35.6,67.82 38.83,71.18 56.02,71.18 57.12,70.07 WGT.3
ANGND  (via drill 0.6, 0.8)  (1 unrouted)
  Top 0.61: C3.2 82.5,62.85 v82.5,61.15 | C4.2 arc90 90.49,69.25 v90.49,71.16
  Bottom 0.406: SJ6.2 90.9,52.27 90.9,53.6 | SJ4.2 88.59,52.25 88.59,53.65
  Bottom 0.61: v90.49,71.16 arc-90 90.41,71.23 | 90.41,71.23
  other vias: 78.98,82.56 78.98,81.37 78.98,80.16 78.98,78.86 92.41,82.59 92.41,81.21 92.41,79.8 92.41,78.41
  pour Bottom (rank 2): 73.82,84.13 95.5,84.13 95.2,51.01 73.4,51.01 73.73,83.51
  pour Top: 77.61,83.62 94.75,83.62 94.75,77.06 77.55,77.06 77.55,83.59
ANT868
  Bottom 0.61: U100.P$23 83.31,77.24 83.31,79.76 84.93,81.37 868MHZ.P
AREF
  Top 0.406: 32U4.42 33.93,60.21 33.94,60.2 34.4,60.65 C10.1
B+
  Top 0.61: U1.10 43.04,64.13 42.86,64.31 38.4,64.31 JP2.1
B-
  Top 0.61: JP2.2 39.46,62.81 U1.9
CN3
  Top 0.61: 44.35,68.44 U1.6 44.33,68.43 44.33,70.63 44.06,70.91 41.23,70.91 40.5,71.63 C8.2
CS_32U4
  Top 0.61: 13.87,75.11 15.37,75.09 16.25,75.97 X3.6 | LDSLAVE.C 12.5,77.17 13.16,76.51 13.16,75.83 13.87,75.11 | R1.1 14.64,70.76 15.41,71.53 15.41,73.58 13.87,75.11
D5*
  Top 0.406: 32U4.31 28.71,47.2 30.13,45.79 32.57,45.79 R6.1
D6*  (via drill 0.8)  (6 unrouted)
  Top 0.406: 32U4.27 25.52,45.41 v23.99,43.89 | v34.79,34.78 34.79,33.52 38.24,30.36 38.24,26.41 35.88,24.9 34.87,23.89 34.87,18.19 34.2,17.51 34.2,16.17
  Bottom 0.406: v23.99,43.89 23.99,43.66 26.91,40.73 28.84,40.73 v34.79,34.78
D8*  (via drill 0.8)
  Top 0.406: 32U4.28 26.32,43.51 v26.37,43.45 | v39,32.27 39,31.11 42.29,27.82 48.14,27.82 48.57,27.39 48.57,26.43 Q4.1
  Bottom 0.406: v26.37,43.45 26.37,43.39 27.69,42.07 29.2,42.07 v39,32.27
D9*  (via drill 0.8)
  Top 0.406: 32U4.29 27.1,44.75 v28.03,44 | Q2.1 48.79,36.31 48.03,37.07 40.7,37.07 v38.3,34.64
  Bottom 0.406: v28.03,44 29.1,43.84 v38.3,34.64
D10*
  Top 0.406: 32U4.30 27.91,46.11 R5.1
D11*
  Top 0.406: 32U4.12 19.71,61.81 17.4,64.12 17.4,65.25 16.43,66.22 16.43,68.06 R1.2
D12*
  Top 0.406: 32U4.26 24.7,46.8 23.99,46.09 11.73,46.09 11.02,45.37 R10.1
D13*
  Top 0.406: 32U4.32 29.5,52 29.5,50.64 30.1,50.05
  Top 0.61: 30.1,50.05 R2.1
GND  (via drill 0.6, 0.8, 0.8 pad 0.41, 0.8 pad 0.81, 0.9, 0.9 pad 0.61, 0.9 pad 0.81)  (1 unrouted)
  Top 0.406: 22.43,59.39 32U4.15 15.8,59.41 C12.1 | 32U4.5 27.11,61.88 v27.12,61.26 | 32U4.23 22.32,50.91 v21.51,50.1 | 32U4.35 34.24,54.61 v34.66,53.95 | 32U4.43 29.86,61.01 v29.63,60.45 | v32.15,63.98 32.84,64.66 C10.2 | v73.11,67.49 73.81,66.79 C5.1 | U$2.4 24.45,25.77 v24.14,25.46 | 32.37,22.34 v32.22,22.19
  Top 0.5: X4.5 87.54,10.92 v87.81,11.19
  Top 0.61: 22.43,59.39 v22.5,59.42 | CX2.1 7.96,62.86 v10.82,62.83 | v9.74,51.3 7.28,51.3 CX1.1 | BKLD.C 36.43,49.61 v37.71,49.61 | CU9.1 74.44,13.95 v74.07,13.92 | SJ3.2 53.98,64.26 v53.09,63.36 | CU1.2 55.06,70.95 C6.2 57.63,72.58 WGT.4 | RK7.1 35.76,51.98 v37.18,53.4 | SJ2.1 28.88,67.8 v27.83,67.21 | X3.7 X3.8 13.11,78.08 v12.29,78.89 | SJ1.1 9.78,68.45 v9.78,65.93 | C13.1 26.94,76.09 v26.78,76.26 | LDIN.C 80.7,49.35 79.67,50.38 78.86,50.38 77.81,49.34 v77.77,49.34 | LDOUT.C 85.83,43.71 v85.83,42.21 | U1.14 48.12,59.46 v47.74,59.08 | LDPW12.C 32.32,19.6 v32.34,19.63 | LDPW3.C 32.19,22.16 v32.22,22.19 | LDPID.C 32.54,17.13 v32.6,17.07 | U$1.VSS 66.36,61.96 64.03,61.96 v63.33,61.26 | CU4.2 39,20.06 v37.99,18.84 | C2.2 37.88,22.38 v37.41,21.91
  Top 0.813: C11.2 11.62,65.94 v9.78,65.93
  Top 1.016: Q1.3 63.64,52.51 v62.55,51.42 | Q4.3 42.81,26.41 v41.78,26.35 | Q2.3 42.71,35.47 v41.4,34.16 | 44.23,44.1 Q3.3 44.36,42.95 v45.15,41.7 | Q5.3 75.05,31.54 v74.53,29.59 | Q6.3 73.73,43.05 v73.73,42.58
  Bottom 0.406: v27.12,61.26 27.18,61.82 | SJ5.1 86.18,51.25 86.18,49.73 | SJ4.1 88.61,51.23 88.61,49.73 | SJ6.1 90.9,51.26 90.9,49.68 | v24.14,25.46 23.55,25.46 23.09,25
  Bottom 0.5: 36.32,79.78 30.7,79.78
  Bottom 0.61: v87.81,11.19 89.47,11.19 | v22.5,59.42 22.9,59.41 23.23,59.07 | 14.79,76.16 14.61,75.98 | 27.18,61.82 27.6,61.4 | v9.74,51.3 9.15,51.3 | v10.82,62.83 10.62,62.85 10.48,62.98 10.22,62.59 | v21.51,50.1 21.51,49.46 21.57,49.4 | 26.93,73.48 28.03,73.48 28.17,73.63 | v34.66,53.95 34.53,53.42 34.62,53.58 | v29.63,60.45 29.3,59.44 29.71,59.49 | v37.71,49.61 38.15,49 38.15,48.62 | v74.07,13.92 73.8,13.96 73.75,14.01 | v53.09,63.36 53.09,62.45 53.23,62.3 53.23,62.32 | v37.18,53.4 37.18,53.57 36.94,53.82 | v12.29,78.89 12.29,79.16 12.54,79.41 | v26.78,76.26 26.21,76.26 26.16,76.32 | v73.11,67.49 72.55,66.94 72.72,66.92 | v77.77,49.34 78.86,50.38 78.82,50.42 | v47.74,59.08 47.32,59.08 47.13,58.89 | v32.22,22.19 32.22,21.76 32.45,21.54 | v32.34,19.63 | v32.34,19.63 32.67,19.3 | v32.6,17.07 32.6,17.22 33,17.62 | v63.33,61.26 | v63.33,61.26 63,60.93 | CON_ISP.GND 36.37,77.52 | 36.37,79.74 36.32,79.78 | 30.7,79.78 29.3,78.38 19.77,78.38 | 31.83,17.27 31.11,16.56 | 29.76,14.54 29.73,14.51
  Bottom 0.813: v9.78,65.93 9.74,64.66 9.85,64.69 | CU8.2 12.47,4.02 IC1.2
  Bottom 1.016: 38.67,24.18 38.63,24.14 | v41.4,34.16 41.4,33.33 41.07,32.99 | v45.15,41.7 45.41,41.31 45.63,41.31 | v74.53,29.59 73.93,28.99 74.45,29.38 | v73.73,42.58 73.28,43.03
  other vias: 28.57,11.44 28.57,12.62 28.15,10.3 27.02,10.25 25.82,10.22 24.68,10.22
  pour Top: 28.62,14.51 28.62,14.55 22.69,14.55 22.69,9.94 28.8,9.94 28.8,14.49 28.58,14.49
  pour Bottom: 4.88,84 72.93,84 72.93,51.33 95.55,51.33 95.55,-1.84 4.67,-1.84 4.67,83.96
HWB
  Top 0.406: RK7.2 30.34,51.98 32U4.33
ISP+5V
  Bottom 0.61: D2.A 36.37,73.45 CON_ISP.5V
LGND
  Top 0.5: 46.23,65.14 41.34,65.14 41.21,65.28 40.27,65.28
  Top 0.61: U1.5 45.58,71.79 8.2K.1 | 44.84,72.54 8.2K.1 | 31.04,67.9 31.04,70.66 32.01,71.63 C8.1 35.8,73.17 C7.2 | 31.04,67.9 31.04,66.81 31.23,66.57 35.64,66.57 35.89,66.37 | SJ2.2 30.89,68.05 31.04,67.9 | 46.23,65.14 46.74,65.66 46.74,66.45 45.57,67.62 45.57,69.66 45.66,69.75 | CU2.2 44.39,72.99 8.2K.1
  pour Top: 56.91,76.59 40.54,76.59 35.69,71.73 35.69,61.38 37.39,59.67 60.36,59.67 63.17,62.49 63.17,73.86 60.66,76.37 58.22,76.35 57.89,76.55 57.34,76.53 57.14,76.55 56.95,76.55
MEM_SEL
  Top 0.61: R3.1 64.78,65.69 U$1.CE 66.8,66.06 LDMEM.C
MISO  (via drill 0.8 pad 0.81, 0.9 pad 0.61)
  Top 0.406: v30.25,73.51 33.5,76.66 37.98,76.66 39.89,78.67 52.27,78.67 52.28,78.66 59.02,78.68 61.32,76.37 61.33,76.36 77.72,76.36 78.11,75.97 78.11,73.77 77.51,73.17 73.62,73.17 72.91,72.46 72.91,70.14 71.1,68.32 69.44,68.32 68.94,67.82 68.94,65.51 67.85,64.42 U$1.SO | 32U4.11 20.97,63.61 v17.8,66.78 17.8,69.06 17.25,69.61 X3.5
  Bottom 0.406: 28.25,72.26 21,72.26 17.8,69.06 v17.8,66.78 | 28.25,72.26 30.85,72.26 CON_ISP.MISO | v30.25,73.51 29.5,73.51 28.25,72.26
MOSI  (via drill 0.8, 0.8 pad 0.81, 0.9 pad 0.61)
  Top 0.406: 32U4.10 23.11,64.8 22.31,65.6 21.25,65.6 19.12,67.73 19.12,68.78 | 19.12,68.78 19.12,69.86 18.25,70.73 X3.4 | 20.11,69.78 19.12,68.78
  Top 0.61: v29.68,71 34.31,75.62 38.16,75.62 40.41,77.78 53.06,77.78 53.22,77.78 58.59,77.76 61.35,75.1 68.95,75.1 69.73,74.32 75.64,74.32 v76.83,74.32 | v20.42,69.78 20.11,69.78 | U$1.SI 77.67,61.88 79.28,63.49 79.28,69.92 v77.86,71.35 77.66,71.54 74.78,71.54 RK4.1
  Bottom 0.61: CON_ISP.MOSI 36.83,76.25 37.92,75.16 37.92,71.48 36.13,69.69 28.29,69.69 | 28.29,69.69 23.57,69.69 22.33,70.93 21.58,70.93 v20.42,69.78 | v29.68,71 29.6,71 28.29,69.69 | v76.83,74.32 77.86,73.29 v77.86,71.35
N$1
  Top 0.406: 32U4.6 26.32,67.62 27.1,68.4 27.1,70.32
  Top 0.61: 27.1,70.32 C13.2
N$2
  Top 2.184: CON2.P$1 18.68,21.62 18.68,14.35 14.39,10.05 HX1.2
N$3
  Top 0.61: BKLD.A 34.22,49.72 R2.2
N$4
  Top 0.406: R11.2 24.88,6.24 arc-90 HX1.1
N$5
  Top 0.61: U1.3 48.12,70.43 BJ1.3 48.19,70.71 48.6,71.13 48.6,73.2 48.99,73.59 48.99,74.24 | 48.99,74.24 48.99,74.61 | 48.99,74.61 20K.2 | 48.99,74.61 57.67,74.61 WGT.5 | 48.99,74.24 49.07,74.32 49.07,75.95 48.73,76.29 45.62,76.29 44.88,75.55 44.66,75.34 44.21,74.89 CU2.1 41.99,75.96 40.19,75.96 38.95,74.72 C7.1
N$6  (3 unrouted)
  Top 0.406: R11.1 28.98,4.21 31.12,6.35 31.12,13.08 32.21,14.17 33.33,14.17 33.43,14.27
N$7
  Top 0.61: R12.1 28.41,19.64 LDPW12.A
N$8  (via drill 0.8)
  Top 0.406: 79.05,47.35 Q6.1 75.95,49.59 71.74,53.81 56.24,53.81 53.79,51.36 v53.79,50.49 | R5.2 30.55,41.56 v33.53,41.56 | v38.14,36.75 38.76,36.75 40.4,38.38 40.4,45.74 45.19,50.54 48.04,50.54 v48.19,50.4
  Top 0.61: 79.05,47.35 RK12.2
  Bottom 0.406: v33.53,41.56 33.53,41.35 v38.14,36.75 | v48.19,50.4 53.7,50.4 v53.79,50.49
N$9
  Top 0.406: R10.2 10.92,37.11 12.53,35.5 17.37,35.5 19.41,33.46 19.41,33.1 | U$2.1 22.5,27.73 19.41,30.82 19.41,33.1 | RT2.2 28.1,31.17 26.98,32.45 20.22,32.45 19.41,33.1
N$10  (2 unrouted)
N$11  (via drill 0.8)
  Top 0.406: 81.33,40.49 RK13.2 | 81.33,40.49 86.48,40.49 87.54,41.54 87.54,44.69 80.19,52.04 76.28,52.04 73.61,54.72 55.15,54.72 52.41,51.98 v52.25,51.82 | R6.2 34.02,43.42 v35.8,41.64 | v38.51,38.81 39.51,39.82 39.51,46.79 44.58,51.86 v46.87,51.86 | 81.33,40.49 78.19,37.34 Q5.1
  Bottom 0.406: v35.8,41.64 35.8,41.6 38.37,39.03 v38.51,38.81 | v46.87,51.86 v52.25,51.82
N$12  (1 unrouted)
  Top 0.406: BJ2.1 34.23,15.11 34.23,17.47
N$13
  Top 0.813: OUT.2 76.47,34.71 Q5.2
N$14
  Top 0.61: RK8.1 67.02,30.24 STEPPER.1
  Top 1.016: Q4.2 46.19,26.04 50.84,21.39 64.54,21.39 67.87,24.72 67.87,30.23 STEPPER.1
N$15
  Top 0.61: RK9.1 63.43,34.26 STEPPER.3
  Top 1.016: Q2.2 46.48,34.6 49.16,31.92 54.52,31.92 55.59,30.86 57.2,30.86 60.02,33.68 62.43,33.68 STEPPER.3
N$16  (via drill 0.8)
  Top 0.61: RK10.1 STEPPER.4
  Top 1.016: Q3.2 46.64,43.3 48.62,41.32 53.44,41.32 v54.5,42.38
  Bottom 1.016: v54.5,42.38 54.5,40.18 59.05,35.62 60.78,35.62 STEPPER.4
N$17
  Top 1.016: Q6.2 74.47,45.72 75.43,44.76 76.52,42.27 74.17,39.92 71.24,39.92 IN.2
N$18
  Top 0.61: RK15.2 19.75,48.32 TX.A
N$19
  Top 0.61: RK11.1 55.78,40.06 STEPPER.6
  Top 1.016: Q1.2 67.58,50.02 69.26,48.34 70.61,48.34 71.07,47.89 71.07,45.42 70.13,44.48 66.98,44.48 66.03,43.52 61.5,43.52 STEPPER.6
N$20  (via drill 0.9 pad 0.81)
  Top 0.61: RL1.1 34.75,69.77 43,69.77 43.04,69.73 U1.7 43.04,67.23 43.88,66.4 v44.83,66.4
  Bottom 0.61: C9.2 44.34,66.89 v44.83,66.4
N$21
  Top 0.406: R9.2 6.48,40.28 9.08,37.69 9.08,32.47 X1.2
  Bottom 0.406: RT1.2 12.01,33.48 X1.2
N$22
  Top 0.61: LDSLAVE.A 8.8,75.07 RK18.2
N$23  (via drill 0.8)
  Top 0.61: U$1.SCK 72.56,63.15 v71.61,62.75 | RK3.2 74.87,79.24 73.1,80.87 v72.4,80.85
  Bottom 0.61: v71.61,62.75 71.63,63.04 71.57,80.22 v72.4,80.85
N$24
  Top 0.61: RXLD.A 24.88,70.52 RK16.2
N$25
  Top 0.61: RK19.2 66.78,70.31 LDMEM.A
N$26
  Top 0.61: RK14.1 28.42,17.03 LDPID.A
N$27
  Top 0.61: RK12.1 80.76,46.4 LDIN.A
N$28
  Top 0.61: RK13.1 82.44,44.26 LDOUT.A
N$29  (2 unrouted)
N$31
  Top 0.61: RK8.2 62.1,27.72 LDM4.C
N$32
  Top 0.61: LDM3.C 59.51,30.15 RK9.2
N$33
  Top 0.61: RK10.2 55.73,34.3 LDM2.C
N$34
  Top 0.61: LDPW3.A R14.2
N$37
  Top 0.61: LDM1.C RK11.2
N$38
  Top 0.61: U1.2 49.39,69.21 BJ1.1
N$39
  Top 0.61: U1.4 46.85,69.87 8.2K.2 46.87,74.71 20K.1
N$41
  Top 0.61: RK5.1 49.41,62.79 U1.15 49.39,64.4 50.6,65.61 SJ3.1
N$42
  Top 0.406: 32U4.17 13.82,57.81 X2.P$2
  Top 0.61: CX1.2 11.45,54.78 12.04,55.37 11.49,55.37 X2.P$2 9.92,56.94 RXT.2
N$43  (via drill 0.9 pad 0.81)
  Top 0.61: RL2.1 40.06,68.41 U1.8 41.77,66.43 v41.89,66.33
  Bottom 0.61: C9.1 42.17,68.73 42.17,66.59 v41.89,66.33
RESET  (via drill 0.8 pad 0.81)
  Top 0.406: 32U4.13 19.05,61.01 16.43,63.63 16.43,64.75 15.13,66.05 15.12,66.04 C11.1
  Top 0.61: v13.67,72.01 12.49,70.86 RK6.1 11.35,70.86 SJ1.2 11.43,68.43 13.38,68.43 14.15,67.55 C11.1
  Bottom 0.61: CON_ISP.RESET 19.15,77.52 v13.67,72.01
RX  (via drill 0.8, 0.9 pad 0.61)
  Top 0.406: 32U4.20 20.48,55.38 17.04,55.38 16.48,54.82 16.48,52.58 15.88,51.98 v15.88,48.61 | v53.68,57.07 57.93,57.07 59.47,58.62 66.34,58.62 v66.78,59.06 | v42.26,52.21 42.26,51.03 38.4,47.18 38.4,40.78 36.36,38.74 24.62,38.76 20.37,42.91 15.99,42.91 v15.97,43.06
  Bottom 0.406: 15.91,48.57 v15.97,43.06 | v53.68,57.07 53.08,57.68 52.09,57.68 49.33,60.44 47.16,60.44 44.24,57.52 44.24,55.45 42.26,53.48 v42.26,52.21 | U100.P$6 75.41,58.19 68.66,58.19 67.78,59.06 v66.78,59.06
  Bottom 0.61: v15.88,48.61 15.91,48.57
RXLED
  Top 0.406: 32U4.8 24.71,66.72
  Top 0.61: 24.71,66.72 RXLD.C
SCK  (via drill 0.8 pad 0.81, 0.9 pad 0.61)
  Top 0.406: 32U4.9 23.91,65.54 21.26,68.19 21.26,68.71 21.87,69.32 21.87,70.25 19.25,72.87 19.25,76.84 | X3.3 19.25,76.84 | 20.79,75.29 19.25,76.84
  Top 0.61: v20.84,75.29 20.79,75.29 | RK3.1 71.64,77.64 61.56,77.64 58.51,80.69 32.01,80.69 29.82,78.5 v29.82,76.2
  Bottom 0.61: 28.26,74.79 31.27,74.79 32.68,76.2 33.52,76.2 CON_ISP.SCK | v29.82,76.2 29.68,76.2 28.26,74.79 | 28.26,74.79 21.35,74.79 v20.84,75.29
SCL  (via drill 0.8 pad 0.81)
  Top 0.406: RK2.2 11.6,53.08 11.8,53.29 13.07,53.29 14.37,54.59 14.37,56.11 15.27,57.01 32U4.18 20.53,57.01 21.69,57.01 22.52,57.85 v23.57,57.85
  Top 0.61: J2.SCL 66.05,4.96 67.2,6.13 71.73,6.13 J1.SCL
  Bottom 0.61: J2.SCL 56.85,4.96 58.66,6.76 58.66,7.9 55.81,10.74 55.81,25.45 23.57,57.68 v23.57,57.85
SDA  (via drill 0.8 pad 0.81)
  Top 0.406: RK1.2 15.4,53.09 15.4,55.48 16.13,56.21 32U4.19 20.53,56.23 v23.03,56.23
  Top 0.61: J1.SDA 71.88,8.15 71.06,8.97 61.89,8.97 59.15,6.23 55.95,6.23 J2.SDA
  Bottom 0.61: v23.03,56.23 23.07,56.23 54.71,24.58 54.71,7.52 J2.SDA
TX  (via drill 0.8, 0.9 pad 0.61)
  Top 0.406: 32U4.21 20.48,54.57 17.89,54.57 17.36,54.04 v17.36,49.84 | v54.19,58.83 58.17,58.83 58.92,59.58 64.17,59.58 v65.17,60.57 | v17.34,44.33 17.36,44.31 21.26,44.31 25.84,39.73 35.96,39.73 37.45,41.21 37.45,47.51 40.91,50.97 v40.91,53.37
  Bottom 0.406: 17.34,49.83 v17.34,44.33 | v54.19,58.83 52.32,58.83 49.8,61.34 46.75,61.34 43.46,58.06 43.46,55.92 v40.91,53.37 | v65.17,60.57 73.13,60.57 74.38,59.32 U100.P$7
  Bottom 0.61: v17.36,49.84 17.34,49.83
TXLED
  Top 0.406: 32U4.22 19.93,53.81 19.63,53.51 19.63,52.68
  Top 0.61: 19.63,52.68 TX.C
USB_N  (via drill 0.3)
  Top 0.406: RUSB1.1 87.12,21.16 87.12,27.98 90.7,31.55 90.7,36.01 88.17,38.54 v88,38.38 | v29.12,65.52 28.71,65.12 32U4.3
  Bottom 0.406: v88,38.38 88.17,38.54 87.41,39.3 81.34,39.3 75.82,44.82 65.18,44.82 63.99,43.64 61.29,43.64 59.71,45.22 59.71,47.62 61.25,49.16 64.37,49.16 65.79,50.57 65.79,52.82 53.34,65.27 50,65.27 47.93,63.2 43.71,63.2 40.65,60.13 40.65,58.35 35.84,58.35 33.63,60.56 33.63,64.93 32.8,65.76 29.36,65.76 v29.12,65.52
USB_P  (via drill 0.3)
  Top 0.406: RUSB2.1 87.78,17.92 87.78,27.71 91.35,31.28 91.35,36.28 88.63,39.01 v88.79,39.17 | v27.93,65.68 27.93,63.62 32U4.4
  Bottom 0.406: v88.79,39.17 88.63,39.01 87.68,39.96 81.62,39.96 76.29,45.29 | 76.29,45.29 | 76.29,45.29 76,45.58 65,45.58 63.72,44.3 61.56,44.3 60.37,45.49 60.37,47.35 61.52,48.5 64.65,48.5 66.44,50.3 66.44,53.09 53.5,66.04 49.84,66.04 47.66,63.85 43.44,63.85 39.99,60.41 39.99,59 36.12,59 34.29,60.83 34.29,65.2 33.07,66.42 28.66,66.42 v27.93,65.68
USBC_N
  Top 0.406: X4.2 85.11,8.01 85.11,13.42 84.16,14.37 RUSB1.2
USBC_P
  Top 0.406: X4.3 85.91,7.97 85.91,13.39 87.47,14.95 RUSB2.2
VDD  (via drill 0.8)
  Top 0.406: 23.66,19.64 20.68,22.63 20.58,24.37 17.69,27.26 v9.79,27.32
  Top 0.61: X3.2 X3.1 20.33,78.99 v20.33,80.09 | R12.2 23.66,19.64
  Bottom 0.406: v9.79,27.32 8.29,25.81 8.29,25.38
  Bottom 0.61: D2.C 40.99,74.43 CU3.1 40.62,78.55 C1.1 arc50 38.53,80.68 20.93,80.68 v20.33,80.09 19.9,80.52 9.16,80.52 8.29,79.65 8.29,25.38 8.29,12.51 10.42,10.37 13.63,10.37 14.8,9.2 14.8,6.94 | D1.C 14.8,6.94 | 14.8,6.94 IC1.1 | D1.C 18.37,6.43 CU7.1 | D4.C 44.08,21.11 31.32,8.35 18.57,8.35 18.1,7.88 18.1,7.17 D1.C
VUSB  (via drill 0.8, 0.8 pad 0.81)
  Top 0.406: 32U4.7 25.52,60.49 26.02,59.98 26.02,57.43 v28.76,55.88 | v59.35,13.85 60.45,12.68
  Top 0.5: X4.1 84.34,9.71 81.79,12.25 81.21,12.25 79.57,13.89 CU9.2
  Top 0.61: v48.74,13.73 48.76,13.53 49.61,12.68 60.45,12.68 72.1,12.68 72.46,13.04 72.46,14.71 73.58,15.83 77.74,15.83 78.75,14.81 CU9.2
  Bottom 0.406: v28.76,55.88 29.02,55.23 59.35,24.89 v59.35,13.85
  Bottom 0.61: D4.A 48.8,14.22 v48.74,13.73
XTAL1
  Top 0.406: 32U4.16 13.48,58.61
  Top 0.61: 13.48,58.61 X2.P$1 | X2.P$1 6.97,60.65 CX2.2 | RXT.1 9.62,58.84 X2.P$1

### Text on the board
tPlace: - | +
tNames: SPI | D11 | MEM SELECT | Rx | IF LoRa | BLK | OPT | OPT | 3V3 | VDD | PID | D12
bNames: LoRa RN2483
tValues: Screen | BerthaV4.4 | BerthaV4.4 | IN | D10 | OUT | A1 | A0 | D9 | D5 | D8 | BerthaV4.4 | BerthaV4.4 | PID
203bmp: C:/Users/G/Pictures/logo_epfl.bmp